# Altium project Hydrophones DAQ.PrjPcb (part 2 of 2)

## Sheet battery.SchDoc
size A
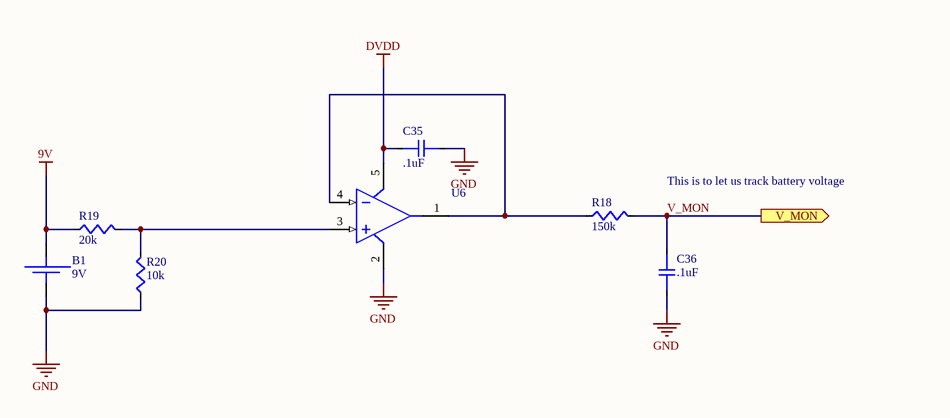
[diagram p4: battery.SchDoc]

### Parts
(Parts that share a designator on the sheet are numbered #1, #2 ... from top to bottom, then left to right.)
B1  9V  [HEADERPINS_2x1_Power]
C35#2  .1uF  [C0603]
C36#2  .1uF  [C0603]
R18#2  150k  [R0603]
R19#2  20k  [R0603]
R20#2  10k  [R0603]
U6#2  OPA325  [SOT-23-5-ALT]  (value not drawn)

### Ports
V_MON (out)

### Nets
9V: B1.+ R19#2.1
DVDD: C35#2.1 U6#2.5(VS+)
GND: B1.- C35#2.2 C36#2.1 R20#2.1 U6#2.2(VS-)
V_MON: C36#2.2 R18#2.2 ; port V_MON
NetR18#2_1: R18#2.1 U6#2.1(OUT) U6#2.4(-IN)
NetR19#2_2: R19#2.2 R20#2.2 U6#2.3(+IN)

### Notes on the sheet
- This is to let us track battery voltage

### Library data of the parts
B1 = 9V_BAT_conn_ 282837-2: Supplier 1: Digi-Key; Supplier Part Number 1: A113320-ND
C35#2 C36#2 = VJ0603Y104JXJCW1BC: 0603 0.1 uF 16 V ±5 % Tolerance X7R SMT Multilayer Ceramic Chip Capacitor; Manufacturer 1: Vishay Vitramon; Dielectric Material: Tantalum; Tolerance: 5%; Capacitance: 100nF; Voltage Rating: 16V; Supplier 1: Digi-Key; Supplier Part Number 1: 720-1685-1-ND; Manufacturer Part Number 1: VJ0603Y104JXJCW1BC; Stock 1: 6936; Pricing 1: 1=0.20000, 10=0.13400, 100=0.06780, 500=0.04636, 1000=0.04101 (USD); RoHS: Yes; Mount: Surface Mount; Case/Package: 0603; Number of Pins: 2; Case Code (Imperial): 0603; Case Code (Metric): 1608; Contact Plating: Tin,Matte; Min Operating Temperature: -55°C; Max Operating Temperature: 125°C; Packaging: Tape and Reel; Voltage Rating (DC): 16V; Package Quantity: 4000; Dielectric: X7R; Termination: SMD/SMT; Length: 1.6mm; Height: 0.95mm; Width: 0.8mm; Depth: 0.8mm; Lead Free: Lead Free; ComponentLink1URL: https://datasheet.ciiva.com/5424/vjw1bcbascomseries-223529-5424533.pdf?src-supplier=Mouser; ComponentLink1Description: https://datasheet.ciiva.com/5424/vjw1bcbascomseries-223529-5424533.pdf?src-supplier=Mouser; ComponentLink2URL: https://datasheet.ciiva.com/11491/vjw1bcbascomseries-11491768.pdf?src-supplier=Avnet; ComponentLink2Description: https://datasheet.ciiva.com/11491/vjw1bcbascomseries-11491768.pdf?src-supplier=Avnet; ComponentLink3URL: https://datasheet.ciiva.com/16215/vjw1bcbascomseries-16215161.pdf?src-supplier=Future+Electronics; ComponentLink3Description: https://datasheet.ciiva.com/16215/vjw1bcbascomseries-16215161.pdf?src-supplier=Future+Electronics
R18#2 = CRGCQ0603F150K: CRGCQ 0603 150K 1%; Manufacturer 1: Yageo; Manufacturer Part Number 1: RC0603JR-0710KL; Resistance: 10kR; Tolerance: 5%; Temperature Coefficient: 100ppm/°C; Voltage Rating (DC): 50V; Power Rating: 100mW; Supplier 1: Digi-Key; Stock 1: 22910838; Pricing 1: 1=0.10000, 10=0.01700, 100=0.00710, 1000=0.00318, 2500=0.00276 (USD); RoHS: Yes; Case/Package: 0603; Number of Pins: 2; Contact Plating: Tin,Matte; Case Code (Imperial): 0603; Case Code (Metric): 1608; Min Operating Temperature: -55°C; Max Operating Temperature: 155°C; Composition: Thick Film; Packaging: Tape and Reel; Voltage Rating: 50V; Termination: SMD/SMT; Military Standard: Not; Length: 1.6mm; Width: 0.8mm; Depth: 0.8mm; Radiation Hardening: No; REACH SVHC: Unknown; Lead Free: Lead Free; ComponentLink1URL: https://datasheet.ciiva.com/2452/pyu-rc0603-51-rohs-l-4-2452848.pdf?src-supplier=Digi-Key; ComponentLink1Description: https://datasheet.ciiva.com/2452/pyu-rc0603-51-rohs-l-4-2452848.pdf?src-supplier=Digi-Key; ComponentLink2URL: https://datasheet.ciiva.com/7746/443971-7746427.pdf?src-supplier=Element14; ComponentLink2Description: https://datasheet.ciiva.com/7746/443971-7746427.pdf?src-supplier=Element14; ComponentLink3URL: https://datasheet.ciiva.com/22747/443971-22747531.pdf?src-supplier=Element14; ComponentLink3Description: https://datasheet.ciiva.com/22747/443971-22747531.pdf?src-supplier=Element14; ComponentLink4URL: https://datasheet.ciiva.com/7746/443971-7746428.pdf?src-supplier=Element14; ComponentLink4Description: https://datasheet.ciiva.com/7746/443971-7746428.pdf?src-supplier=Element14; ComponentLink5URL: https://datasheet.ciiva.com/15189/getdatasheetpartid-327958-15189847.pdf?src-supplier=Verical; ComponentLink5Description: https://datasheet.ciiva.com/15189/getdatasheetpartid-327958-15189847.pdf?src-supplier=Verical; ComponentLink6URL: https://datasheet.ciiva.com/8883/pyu-rc0603-51-rohs-l-4-8883049.pdf?src-supplier=Avnet; ComponentLink6Description: https://datasheet.ciiva.com/8883/pyu-rc0603-51-rohs-l-4-8883049.pdf?src-supplier=Avnet; Supplier Part Number 1: 311-10KGRCT-ND
R19#2 = MCT06030E2002BP500: Res Thin Film 0603 20K Ohm 0.1% 0.1W(1/10W) ±15ppm/C Molded SMD Automotive Medical Paper T/R; Manufacturer 1: Vishay Semiconductors; Resistance: 20kR; Temperature Coefficient: 15ppm/°C; Supplier 1: Digi-Key; Manufacturer Part Number 1: MCT06030E2002BP500; Stock 1: 75960; Pricing 1: 1=0.70000, 10=0.58600, 100=0.39360, 1000=0.23128 (USD); RoHS: Yes; Case/Package: 0603; Contact Plating: Tin; Min Operating Temperature: -55°C; Max Operating Temperature: 125°C; Tolerance: 0.1%; Composition: Thin Film; Packaging: Tape and Reel; Military Standard: Not; Length: 1.55mm; Depth: 0.85mm; Radiation Hardening: No; Lead Free: Lead Free; ComponentLink1URL: https://datasheet.ciiva.com/17185/mc-pre-17185448.pdf?src-supplier=Avnet+Europe; ComponentLink1Description: https://datasheet.ciiva.com/17185/mc-pre-17185448.pdf?src-supplier=Avnet+Europe; ComponentLink2URL: https://datasheet.ciiva.com/8897/mc-pre-8897916.pdf?src-supplier=Avnet; ComponentLink2Description: https://datasheet.ciiva.com/8897/mc-pre-8897916.pdf?src-supplier=Avnet; Supplier Part Number 1: 749-1747-1-ND
R20#2 = RC0603JR-0710KL: RES SMD 10K OHM 5% 1/10W 0603
U6#2 = OPA325IDBVR: Manufacturer 1: Texas Instruments; Supplier 1: Digi-Key; Supplier Part Number 1: 296-OPA325IDBVRCT-ND; Manufacturer Part Number 1: OPA325IDBVR; Stock 1: 2034; Pricing 1: 1=1.69000, 10=1.51600, 25=1.43000, 100=1.14400, 250=1.00100, 500=0.97240, 1000=0.77220 (USD); RoHS: No

## Sheet Ref.SchDoc
size A
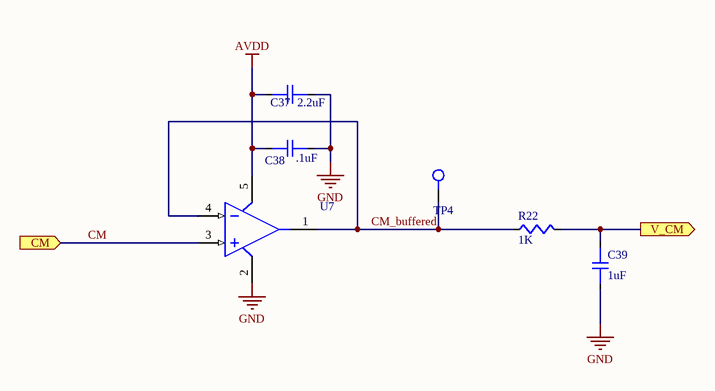
[diagram p5: Ref.SchDoc]

### Parts
(Parts that share a designator on the sheet are numbered #1, #2 ... from top to bottom, then left to right.)
C37  2.2uF  [C0603]
C38  .1uF  [C0603]
C39  1uF  [C0603]
R22#2  1K  [R0603]
TP4  TP  [TP_5029]  (value not drawn)
U7#2  OPA325  [SOT-23-5]  (value not drawn)

### Ports
CM (in), V_CM (out)

### Nets
AVDD: C37.1 C38.1 U7#2.5(VS+)
GND: C37.2 C38.2 C39.1 U7#2.2(VS-)
V_CM: C39.2 R22#2.2 ; port V_CM
CM: U7#2.3(+IN) ; port CM
CM_buffered: R22#2.1 TP4.1 U7#2.1(OUT) U7#2.4(-IN)

### Library data of the parts
C37 = VJ0603Y224KXJCW1BC: Cap Ceramic 0.22uF 16V X7R 10% SMD 0603 125C Paper T/R; Manufacturer 1: Vishay Vitramon; Dielectric Material: Tantalum; Capacitance: 220nF; Supplier 1: Digi-Key; Supplier Part Number 1: 720-1853-1-ND; Manufacturer Part Number 1: VJ0603Y224KXJCW1BC; Stock 1: 890490; Pricing 1: 1=0.10000, 10=0.07000, 100=0.03100, 500=0.02214, 1000=0.01739 (USD); RoHS: Yes; Mount: Surface Mount; Case/Package: 0603; Min Operating Temperature: -55°C; Max Operating Temperature: 125°C; Tolerance: 10%; Packaging: Tape and Reel; Dielectric: X7R; Voltage Rating (DC): 16V; Length: 1.6mm; Depth: 0.8mm; Lead Free: Lead Free; ComponentLink1URL: https://datasheet.ciiva.com/11490/vjw1bcbascomseries-11490982.pdf?src-supplier=Avnet; ComponentLink1Description: https://datasheet.ciiva.com/11490/vjw1bcbascomseries-11490982.pdf?src-supplier=Avnet
C38 = VJ0603Y104JXJCW1BC: as C35#2 on sheet battery; Supplier 1: Digi-Key; Supplier Part Number 1: 720-1685-1-ND; Manufacturer Part Number 1: VJ0603Y104JXJCW1BC; Stock 1: 6936; Pricing 1: 1=0.20000, 10=0.13400, 100=0.06780, 500=0.04636, 1000=0.04101 (USD); RoHS: Yes; Mount: Surface Mount; Case/Package: 0603; Number of Pins: 2; Case Code (Imperial): 0603; Case Code (Metric): 1608; Contact Plating: Tin,Matte; Min Operating Temperature: -55°C; Max Operating Temperature: 125°C; Packaging: Tape and Reel; Voltage Rating (DC): 16V; Package Quantity: 4000; Dielectric: X7R; Termination: SMD/SMT; Length: 1.6mm; Height: 0.95mm; Width: 0.8mm; Depth: 0.8mm; Lead Free: Lead Free; ComponentLink1URL: https://datasheet.ciiva.com/5424/vjw1bcbascomseries-223529-5424533.pdf?src-supplier=Mouser; ComponentLink1Description: https://datasheet.ciiva.com/5424/vjw1bcbascomseries-223529-5424533.pdf?src-supplier=Mouser; ComponentLink2URL: https://datasheet.ciiva.com/11491/vjw1bcbascomseries-11491768.pdf?src-supplier=Avnet; ComponentLink2Description: https://datasheet.ciiva.com/11491/vjw1bcbascomseries-11491768.pdf?src-supplier=Avnet; ComponentLink3URL: https://datasheet.ciiva.com/16215/vjw1bcbascomseries-16215161.pdf?src-supplier=Future+Electronics; ComponentLink3Description: https://datasheet.ciiva.com/16215/vjw1bcbascomseries-16215161.pdf?src-supplier=Future+Electronics
C39 = CL10B105KO8NNNC: Cap Ceramic 1uF 16V X7R 10% SMD 0603 125C T/R; Manufacturer 1: Samsung; Supplier 1: Digi-Key; Supplier Part Number 1: 1276-1019-1-ND; Manufacturer Part Number 1: CL10B105KO8NNNC; Stock 1: 4048324; Pricing 1: 1=0.10000, 10=0.04800, 100=0.02120, 500=0.01516, 1000=0.01192 (USD); RoHS: Yes; Mount: Surface Mount; Case/Package: 0603; Case Code (Metric): 1608; Case Code (Imperial): 0603; Material: Ceramic; Min Operating Temperature: -55°C; Max Operating Temperature: 125°C; Packaging: Tape and Reel; Tolerance: 10%; Capacitance: 1uF; Voltage Rating: 16V; Dielectric: X7R; Voltage: 16V; Voltage Rating (DC): 16V; Length: 1.6mm; Height: 0.8mm; Width: 0.031inch; Thickness: 0.035inch; Depth: 0.8mm; Radiation Hardening: No; Lead Free: Lead Free; ComponentLink1URL: https://datasheet.ciiva.com/15195/getdatasheetpartid-357418-15195728.pdf?src-supplier=Verical; ComponentLink1Description: https://datasheet.ciiva.com/15195/getdatasheetpartid-357418-15195728.pdf?src-supplier=Verical; ComponentLink2URL: https://datasheet.ciiva.com/29198/458176-da-01-en-vs-kondensator-0603-29198478.pdf?src-supplier=Conrad; ComponentLink2Description: https://datasheet.ciiva.com/29198/458176-da-01-en-vs-kondensator-0603-29198478.pdf?src-supplier=Conrad
R22#2 = TNPW06031K00BEEA: RES 1K OHM 0.1% 1/8W 0603; Manufacturer 1: Vishay Dale; Tolerance: 1%; Resistance: 1kR; Temperature Coefficient: 25ppm/°C; Power Rating: 100mW; Voltage Rating: 75V; Supplier 1: Digi-Key; Supplier Part Number 1: TNP1.00KAACT-ND; Manufacturer Part Number 1: TNPW06031K00BEEA; Stock 1: 92047; Pricing 1: 1=0.65000, 10=0.46200, 100=0.24020, 1000=0.12936, 2500=0.12760 (USD); RoHS: Yes; Mount: Surface Mount; Case/Package: 0603; Weight: 7.1E-05oz; Contact Plating: Tin; Case Code (Metric): 1608; Case Code (Imperial): 0603; Min Operating Temperature: -55°C; Max Operating Temperature: 125°C; Composition: Thin Film; Packaging: Tape and Reel; Package Quantity: 1; Number of Terminations: 2; Termination: SMD/SMT; Military Standard: Not; Max Power Dissipation: 100mW; Voltage Rating (DC): 75V; Features: Moisture Resistant,Automotive AEC-Q200,Anti-Sulfur; Length: 1.6mm; Height: 0.45mm; Width: 0.033inch; Depth: 0.85mm; Radiation Hardening: No; REACH SVHC: Unknown; Lead Free: Lead Free; ComponentLink1URL: https://datasheet.ciiva.com/2528/tnpw-e3-2528472.pdf?src-supplier=Digi-Key; ComponentLink1Description: https://datasheet.ciiva.com/2528/tnpw-e3-2528472.pdf?src-supplier=Digi-Key; ComponentLink2URL: https://datasheet.ciiva.com/2528/tnpw-e3-2528473.pdf?src-supplier=Digi-Key; ComponentLink2Description: https://datasheet.ciiva.com/2528/tnpw-e3-2528473.pdf?src-supplier=Digi-Key; ComponentLink3URL: https://datasheet.ciiva.com/9112/tnpw-e3-9112138.pdf?src-supplier=Avnet; ComponentLink3Description: https://datasheet.ciiva.com/9112/tnpw-e3-9112138.pdf?src-supplier=Avnet; ComponentLink4URL: https://datasheet.ciiva.com/16391/tnpw-e3-16391675.pdf?src-supplier=Future+Electronics; ComponentLink4Description: https://datasheet.ciiva.com/16391/tnpw-e3-16391675.pdf?src-supplier=Future+Electronics; ComponentLink5URL: https://datasheet.ciiva.com/9112/tnpw-e3-9112141.pdf?src-supplier=Avnet; ComponentLink5Description: https://datasheet.ciiva.com/9112/tnpw-e3-9112141.pdf?src-supplier=Avnet; ComponentLink6URL: https://datasheet.ciiva.com/16782/70201627-16782047.pdf?src-supplier=Allied+Electronics; ComponentLink6Description: https://datasheet.ciiva.com/16782/70201627-16782047.pdf?src-supplier=Allied+Electronics
TP4 = TP: RCT-0C SMD 0805 TP; Supplier 1: Digi-Key; Supplier Part Number 1: A106144CT-ND
U7#2 = OPA325IDBVR: Manufacturer 1: Texas Instruments; Supplier 1: Digi-Key; Supplier Part Number 1: 296-OPA325IDBVRCT-ND; Manufacturer Part Number 1: OPA325IDBVR; Stock 1: 2034; Pricing 1: 1=1.69000, 10=1.51600, 25=1.43000, 100=1.14400, 250=1.00100, 500=0.97240, 1000=0.77220 (USD); RoHS: No

## Sheet 3V3Supply.SchDoc
size A
Used 2 times, as channels DVDD, AVDD. Parts and nets are listed once, with the designators drawn on the sheet.
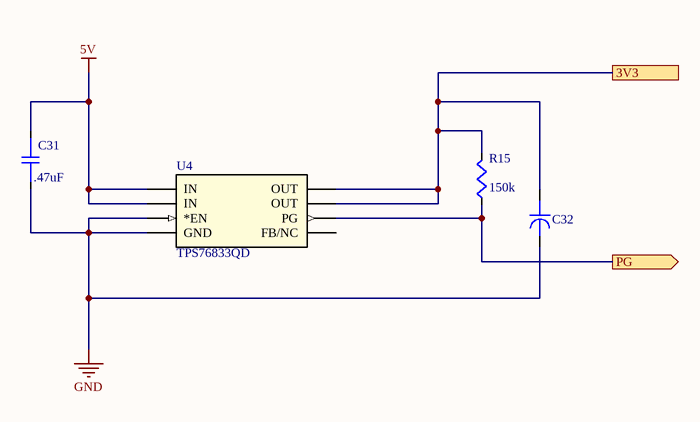
[diagram p6: 3V3Supply.SchDoc]

### Parts
C31  .47uF  [C0603]
C32  22UF TANT  [CAP_293D_D_VIS]  (value not drawn)
R15  150k  [R0603]
U4  TPS76833QD  [D8_TEX]

### Ports
3V3, PG (out)

### Nets
5V: C31.2 U4.3(IN) U4.4(IN)
GND: C31.1 C32.1 U4.1(GND) U4.2(*EN)
3V3: C32.2 R15.2 U4.5(OUT) U4.6(OUT) ; port 3V3
PG: R15.1 U4.8(PG) ; port PG

Not connected (* = marked no-connect by the designer): U4 7(FB/NC)

### Channels
DVDD: designators C31=C70 C32=C68 R15=R50 U4=U15; ports 3V3=DVDD PG=DVDD_PG
AVDD: designators C31=C60 C32=C47 R15=R34 U4=U11; ports 3V3=AVDD PG=AVDD_PG

### Library data of the parts
C31 = C0603C474J4RACAUTO: KEMET - C0603C474J4RACAUTO - CAP, 0.47µF, 16V, 5%, X7R, 0603; Capacitance: 470nF; Supplier 1: Digi-Key; Supplier Part Number 1: 399-17596-1-ND; Manufacturer 1: KEMET; Manufacturer Part Number 1: C0603C474J4RACAUTO; Stock 1: 10040; Pricing 1: 1=0.51000, 10=0.35800, 100=0.23570, 500=0.17462, 1000=0.14842 (USD); RoHS: Yes; Case/Package: 0603; Min Operating Temperature: -55°C; Max Operating Temperature: 125°C; Dielectric: X7R; Tolerance: 5%; Packaging: Tape and Reel; Length: 1.6mm; Depth: 0.8mm; ComponentLink1URL: http://www.farnell.com/datasheets/2749769.pdf?src-supplier=Farnell; ComponentLink1Description: http://www.farnell.com/datasheets/2749769.pdf?src-supplier=Farnell; ComponentLink2URL: http://components.arrow.com/part/dataview/0323_07310140?src-supplier=Arrow+Europe; ComponentLink2Description: http://components.arrow.com/part/dataview/0323_07310140?src-supplier=Arrow+Europe; ComponentLink3URL: https://api.kemet.com/component-edge/download/datasheet/C0603C474J4RACAUTO.pdf?src-supplier=Digi-Key; ComponentLink3Description: https://api.kemet.com/component-edge/download/datasheet/C0603C474J4RACAUTO.pdf?src-supplier=Digi-Key; ComponentLink4URL: http://www.farnell.com/datasheets/2749769.pdf?src-supplier=Element14; ComponentLink4Description: http://www.farnell.com/datasheets/2749769.pdf?src-supplier=Element14; ComponentLink5URL: http://www.farnell.com/datasheets/2749769.pdf?src-supplier=Newark; ComponentLink5Description: http://www.farnell.com/datasheets/2749769.pdf?src-supplier=Newark
C32 = 293D226X9035D2TE3: CAP TANT 22UF 10% 35V 2917; Manufacturer 1: Vishay Sprague; Dielectric Material: Tantalum; ESR (Equivalent Series Resistance): 600mR; Polarity: Polar; Ripple Current: 500mA; Dissipation Factor: 6%; Voltage Rating (DC): 300kV; Leakage Current: 7.7uA; Supplier 1: Digi-Key; Supplier Part Number 1: 718-1071-1-ND; Manufacturer Part Number 1: 293D226X9035D2TE3; RoHS: Yes; Category: Tantalum Capacitors; Stock 1: 31; Pricing 1: 1=1.00000, 10=0.78800, 50=0.68260, 100=0.59060 (USD); Mount: Surface Mount,PCB; Case/Package: 2917; Case Code (Imperial): 2917; Case Code (Metric): 7343; Weight: 0.023634oz; Min Operating Temperature: -55°C; Max Operating Temperature: 125°C; Capacitance: 22uF; Tolerance: 10%; Voltage: 35V; Voltage Rating: 35V; Packaging: Tape and Reel; Package Quantity: 1; Termination: SMD/SMT; Features: General Purpose; Length: 7.3mm; Width: 2.8mm; Height: 2.8mm; Depth: 4.3mm; Height - Seated (Max): 0.122inch; Radiation Hardening: No; Lead Free: Lead Free; REACH SVHC: Unknown; ComponentLink1URL: https://datasheet.ciiva.com/11793/0900766b80d97b37-11793792.pdf?src-supplier=RSComponents; ComponentLink1Description: https://datasheet.ciiva.com/11793/0900766b80d97b37-11793792.pdf?src-supplier=RSComponents; ComponentLink2URL: https://datasheet.ciiva.com/3003/293d-3003938.pdf?src-supplier=Avnet; ComponentLink2Description: https://datasheet.ciiva.com/3003/293d-3003938.pdf?src-supplier=Avnet; ComponentLink3URL: https://datasheet.ciiva.com/16357/293d-16357928.pdf?src-supplier=Future+Electronics; ComponentLink3Description: https://datasheet.ciiva.com/16357/293d-16357928.pdf?src-supplier=Future+Electronics; ComponentLink4URL: https://datasheet.ciiva.com/22695/438417-22695144.pdf?src-supplier=Element14; ComponentLink4Description: https://datasheet.ciiva.com/22695/438417-22695144.pdf?src-supplier=Element14; ComponentLink5URL: https://datasheet.ciiva.com/260/293d-260029.pdf?src-supplier=Digi-Key; ComponentLink5Description: https://datasheet.ciiva.com/260/293d-260029.pdf?src-supplier=Digi-Key; ComponentLink6URL: https://datasheet.ciiva.com/260/293d-260031.pdf?src-supplier=Digi-Key; ComponentLink6Description: https://datasheet.ciiva.com/260/293d-260031.pdf?src-supplier=Digi-Key; ComponentLink7URL: https://datasheet.ciiva.com/1463/438417-1463353.pdf?src-supplier=Element14; ComponentLink7Description: https://datasheet.ciiva.com/1463/438417-1463353.pdf?src-supplier=Element14; ComponentLink8URL: https://datasheet.ciiva.com/260/293d-260030.pdf?src-supplier=Digi-Key; ComponentLink8Description: https://datasheet.ciiva.com/260/293d-260030.pdf?src-supplier=Digi-Key
R15 = CRGCQ0603F150K: as R18#2 on sheet battery; Supplier 1: Digi-Key; Stock 1: 22910838; Pricing 1: 1=0.10000, 10=0.01700, 100=0.00710, 1000=0.00318, 2500=0.00276 (USD); RoHS: Yes; Case/Package: 0603; Number of Pins: 2; Contact Plating: Tin,Matte; Case Code (Imperial): 0603; Case Code (Metric): 1608; Min Operating Temperature: -55°C; Max Operating Temperature: 155°C; Composition: Thick Film; Packaging: Tape and Reel; Voltage Rating: 50V; Termination: SMD/SMT; Military Standard: Not; Length: 1.6mm; Width: 0.8mm; Depth: 0.8mm; Radiation Hardening: No; REACH SVHC: Unknown; Lead Free: Lead Free; ComponentLink1URL: https://datasheet.ciiva.com/2452/pyu-rc0603-51-rohs-l-4-2452848.pdf?src-supplier=Digi-Key; ComponentLink1Description: https://datasheet.ciiva.com/2452/pyu-rc0603-51-rohs-l-4-2452848.pdf?src-supplier=Digi-Key; ComponentLink2URL: https://datasheet.ciiva.com/7746/443971-7746427.pdf?src-supplier=Element14; ComponentLink2Description: https://datasheet.ciiva.com/7746/443971-7746427.pdf?src-supplier=Element14; ComponentLink3URL: https://datasheet.ciiva.com/22747/443971-22747531.pdf?src-supplier=Element14; ComponentLink3Description: https://datasheet.ciiva.com/22747/443971-22747531.pdf?src-supplier=Element14; ComponentLink4URL: https://datasheet.ciiva.com/7746/443971-7746428.pdf?src-supplier=Element14; ComponentLink4Description: https://datasheet.ciiva.com/7746/443971-7746428.pdf?src-supplier=Element14; ComponentLink5URL: https://datasheet.ciiva.com/15189/getdatasheetpartid-327958-15189847.pdf?src-supplier=Verical; ComponentLink5Description: https://datasheet.ciiva.com/15189/getdatasheetpartid-327958-15189847.pdf?src-supplier=Verical; ComponentLink6URL: https://datasheet.ciiva.com/8883/pyu-rc0603-51-rohs-l-4-8883049.pdf?src-supplier=Avnet; ComponentLink6Description: https://datasheet.ciiva.com/8883/pyu-rc0603-51-rohs-l-4-8883049.pdf?src-supplier=Avnet; Supplier Part Number 1: 311-10KGRCT-ND
U4 = TPS76833QD: 3.3V Linear Voltage Regulator IC 1 Output 1A 8-SOIC; Vendor: Texas Instruments; Built_By: EMA_UL_Team; SourceLibrary: TI_2011-12-14_2; Manufacturer_Part_Number: TPS76833QD; Copyright: Copyright (C) 2018 Accelerated Designs. All rights reserved; RefDes: RefDes; Type: DEV

## Sheet 5VSupply.SchDoc
size A
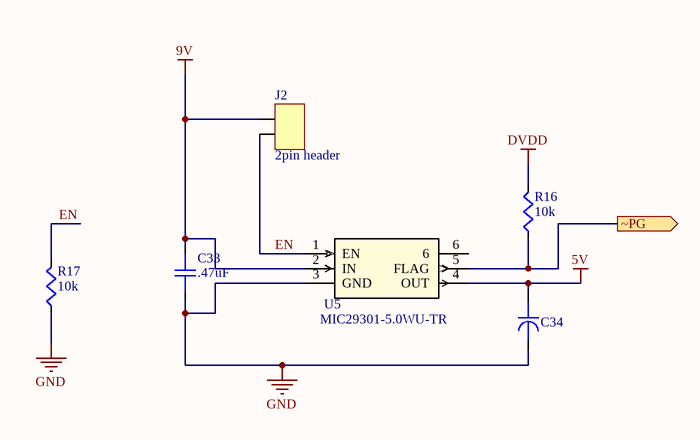
[diagram p7: 5VSupply.SchDoc]

### Parts
(Parts that share a designator on the sheet are numbered #1, #2 ... from top to bottom, then left to right.)
C33#2  .47uF  [C0805]
C34#2  22UF TANT  [CAP_293D_D_VIS]  (value not drawn)
J2#2  2pin header  [HEADERPINS_2x1]
R16#2  10k  [R0603]
R17#2  10k  [R0603]
U5#2  MIC29301-5.0WU-TR  [TO-263-5_MCH]

### Ports
~PG (out)

### Nets
5V: C34#2.2 U5#2.4(OUT)
9V: C33#2.2 J2#2.2 U5#2.2(IN)
DVDD: R16#2.2
GND: C33#2.1 C34#2.1 R17#2.1 U5#2.3(GND)
EN: J2#2.1 R17#2.2 U5#2.1(EN)
~5V_PG: R16#2.1 U5#2.5(FLAG) ; port ~PG

Not connected (* = marked no-connect by the designer): U5#2 6

### Library data of the parts
C33#2 = VJ0805Y474JXJTW1BC: Multilayer Ceramic Capacitors MLCC - SMD/SMT 0805 0.47uF 16volts X7R 5%; Manufacturer 1: Vishay Vitramon; Dielectric Material: Tantalum; Voltage Rating (DC): 16V; Capacitance: 470nF; Supplier 1: Digi-Key; Supplier Part Number 1: 720-1774-1-ND; Manufacturer Part Number 1: VJ0805Y474JXJTW1BC; Stock 1: 1897; Pricing 1: 1=0.39000, 10=0.27000, 100=0.16180, 500=0.12132, 1000=0.10245 (USD); RoHS: Yes; Mount: Surface Mount; Case/Package: 0805; Case Code (Imperial): 0805; Case Code (Metric): 2012; Min Operating Temperature: -55°C; Max Operating Temperature: 125°C; Tolerance: 5%; Packaging: Tape and Reel; Package Quantity: 3000; Dielectric: X7R; Termination: SMD/SMT; Length: 2mm; Height: 1.45mm; Width: 1.25mm; Depth: 1.25mm; Lead Free: Lead Free; ComponentLink1URL: https://datasheet.ciiva.com/11490/vjw1bcbascomseries-11490678.pdf?src-supplier=Avnet; ComponentLink1Description: https://datasheet.ciiva.com/11490/vjw1bcbascomseries-11490678.pdf?src-supplier=Avnet; ComponentLink2URL: https://datasheet.ciiva.com/5427/vjw1bcbascomseries-223529-5427159.pdf?src-supplier=Mouser; ComponentLink2Description: https://datasheet.ciiva.com/5427/vjw1bcbascomseries-223529-5427159.pdf?src-supplier=Mouser
C34#2 = 293D226X9035D2TE3: as C32 on sheet 3V3Supply; Supplier 1: Digi-Key; Supplier Part Number 1: 718-1071-1-ND; Manufacturer Part Number 1: 293D226X9035D2TE3; RoHS: Yes; Category: Tantalum Capacitors; Stock 1: 31; Pricing 1: 1=1.00000, 10=0.78800, 50=0.68260, 100=0.59060 (USD); Mount: Surface Mount,PCB; Case/Package: 2917; Case Code (Imperial): 2917; Case Code (Metric): 7343; Weight: 0.023634oz; Min Operating Temperature: -55°C; Max Operating Temperature: 125°C; Capacitance: 22uF; Tolerance: 10%; Voltage: 35V; Voltage Rating: 35V; Packaging: Tape and Reel; Package Quantity: 1; Termination: SMD/SMT; Features: General Purpose; Length: 7.3mm; Width: 2.8mm; Height: 2.8mm; Depth: 4.3mm; Height - Seated (Max): 0.122inch; Radiation Hardening: No; Lead Free: Lead Free; REACH SVHC: Unknown; ComponentLink1URL: https://datasheet.ciiva.com/11793/0900766b80d97b37-11793792.pdf?src-supplier=RSComponents; ComponentLink1Description: https://datasheet.ciiva.com/11793/0900766b80d97b37-11793792.pdf?src-supplier=RSComponents; ComponentLink2URL: https://datasheet.ciiva.com/3003/293d-3003938.pdf?src-supplier=Avnet; ComponentLink2Description: https://datasheet.ciiva.com/3003/293d-3003938.pdf?src-supplier=Avnet; ComponentLink3URL: https://datasheet.ciiva.com/16357/293d-16357928.pdf?src-supplier=Future+Electronics; ComponentLink3Description: https://datasheet.ciiva.com/16357/293d-16357928.pdf?src-supplier=Future+Electronics; ComponentLink4URL: https://datasheet.ciiva.com/22695/438417-22695144.pdf?src-supplier=Element14; ComponentLink4Description: https://datasheet.ciiva.com/22695/438417-22695144.pdf?src-supplier=Element14; ComponentLink5URL: https://datasheet.ciiva.com/260/293d-260029.pdf?src-supplier=Digi-Key; ComponentLink5Description: https://datasheet.ciiva.com/260/293d-260029.pdf?src-supplier=Digi-Key; ComponentLink6URL: https://datasheet.ciiva.com/260/293d-260031.pdf?src-supplier=Digi-Key; ComponentLink6Description: https://datasheet.ciiva.com/260/293d-260031.pdf?src-supplier=Digi-Key; ComponentLink7URL: https://datasheet.ciiva.com/1463/438417-1463353.pdf?src-supplier=Element14; ComponentLink7Description: https://datasheet.ciiva.com/1463/438417-1463353.pdf?src-supplier=Element14; ComponentLink8URL: https://datasheet.ciiva.com/260/293d-260030.pdf?src-supplier=Digi-Key; ComponentLink8Description: https://datasheet.ciiva.com/260/293d-260030.pdf?src-supplier=Digi-Key
J2#2 = J2
R16#2 R17#2 = RC0603JR-0710KL: RES SMD 10K OHM 5% 1/10W 0603
U5#2 = MIC29301-5.0WU-TR: LDO Regulator Pos 5V 3A Automotive 6-Pin(5+Tab) TO-263 T/R; Manufacturer 1: Microchip; Supplier 1: Digi-Key; Supplier Part Number 1: MIC29301-5.0WU-CT-ND; Manufacturer Part Number 1: MIC29301-5.0WU-TR; RoHS: Yes; Category: Voltage Regulators - Linear; Stock 1: 1017; Pricing 1: 1=4.14000, 25=3.45000, 100=3.14000 (USD); ComponentLink1URL: https://datasheet.ciiva.com/16389/mic29150-16389820.pdf?src-supplier=Future+Electronics; ComponentLink1Description: https://datasheet.ciiva.com/16389/mic29150-16389820.pdf?src-supplier=Future+Electronics; ComponentLink2URL: https://datasheet.ciiva.com/2064/mic29150-2064680.pdf?src-supplier=Digi-Key; ComponentLink2Description: https://datasheet.ciiva.com/2064/mic29150-2064680.pdf?src-supplier=Digi-Key

## Sheet Teensy.SchDoc
size A
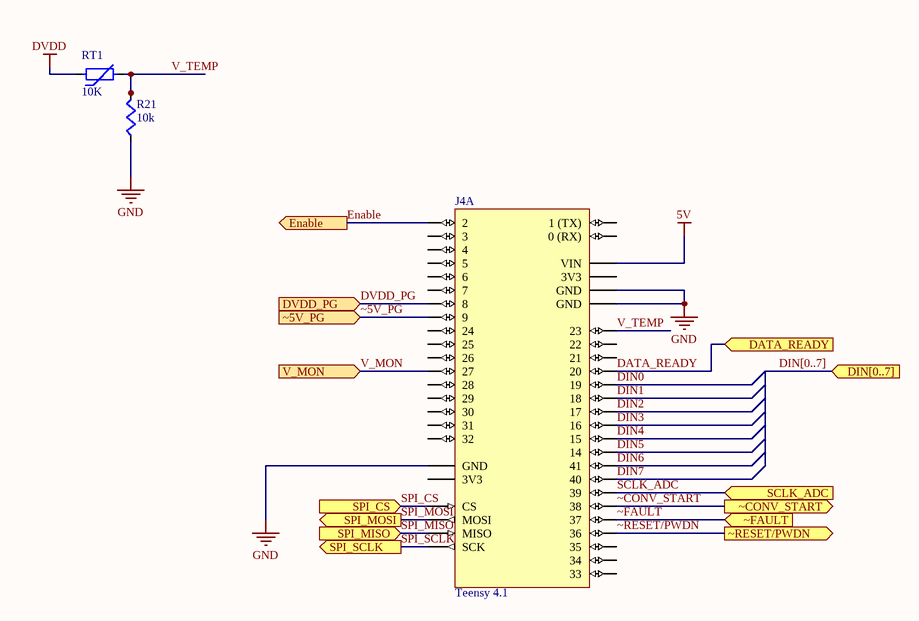
[diagram p8: Teensy.SchDoc]

### Parts
(Parts that share a designator on the sheet are numbered #1, #2 ... from top to bottom, then left to right.)
J4#2  Teensy 4.1  [Teensy4.1]  (part A of 2)
R21#2  10k  [R0603]
RT1  10K  [R0603]

### Ports
DATA_READY (in), DIN[0..7] (in), DVDD_PG (in), Enable (out), SCLK_ADC (in), SPI_CS (in), SPI_MISO (in), SPI_MOSI (out), SPI_SCLK (out), V_MON (in), ~5V_PG (in), ~CONV_START (out), ~FAULT (in), ~RESET/PWDN (out)

### Nets
5V: J4#2.48(VIN)
DVDD: RT1.1
GND: J4#2.1(GND) J4#2.34(GND) J4#2.47(GND) R21#2.1
DATA_READY: J4#2.42(20) ; port DATA_READY
DIN0: J4#2.41(19)  [project net ADC_DATA0]
DIN1: J4#2.40(18)  [project net ADC_DATA1]
DIN2: J4#2.39(17)  [project net ADC_DATA2]
DIN3: J4#2.38(16)  [project net ADC_DATA3]
DIN4: J4#2.37(15)  [project net ADC_DATA4]
DIN5: J4#2.36(14)  [project net ADC_DATA5]
DIN6: J4#2.33(41)  [project net ADC_DATA6]
DIN7: J4#2.32(40)  [project net ADC_DATA7]
DVDD_PG: J4#2.10(8) ; port DVDD_PG
Enable: J4#2.4(2) ; port Enable
SCLK_ADC: J4#2.31(39) ; port SCLK_ADC
SPI_CS: J4#2.12(CS) ; port SPI_CS
SPI_MISO: J4#2.14(MISO) ; port SPI_MISO  [project net MISO_ADC]
SPI_MOSI: J4#2.13(MOSI) ; port SPI_MOSI  [project net MOSI_ADC]
SPI_SCLK: J4#2.35(SCK) ; port SPI_SCLK  [project net SPI_CLK]
V_MON: J4#2.19(27) ; port V_MON
V_TEMP: J4#2.45(23) R21#2.2 RT1.2
~5V_PG: J4#2.11(9) ; port ~5V_PG
~CONV_START: J4#2.30(38) ; port ~CONV_START
~FAULT: J4#2.29(37) ; port ~FAULT
~RESET/PWDN: J4#2.28(36) ; port ~RESET/PWDN

Not connected (* = marked no-connect by the designer): J4#2 2(0_(RX)) 3(1_(TX)) 5(3) 6(4) 7(5) 8(6) 9(7) 15(3V3) 16(24) 17(25) 18(26) 20(28) 21(29) 22(30) 23(31) 24(32) 25(33) 26(34) 27(35) 43(21) 44(22) 46(3V3)

### Buses and harness runs
bus DIN[0..7] = port DIN[0..7]

### Library data of the parts
J4#2 = Teensy4.1
R21#2 = RC0603JR-0710KL: RES SMD 10K OHM 5% 1/10W 0603
RT1 = ERT-J1VG103JA: Thermistor NTC 10KOhm 5% 2-Pin 0603 Punched Carrier T/R; Manufacturer 1: Panasonic; Max Power Dissipation: 100mW; Accuracy: 1%; Resistance: 10kR; Supplier 1: Digi-Key; Supplier Part Number 1: P12014CT-ND; Manufacturer Part Number 1: ERT-J1VG103JA; Stock 1: 47318; Pricing 1: 1=0.15000, 5=0.14600, 10=0.13000, 25=0.12000, 50=0.09600, 100=0.08240, 500=0.07208, 1000=0.06178 (USD); RoHS: Yes; Mount: Surface Mount; Case/Package: 0603; Number of Pins: 2; Case Code (Metric): 1608; Case Code (Imperial): 0603; Min Operating Temperature: -40°C; Max Operating Temperature: 125°C; Termination: SMD/SMT; Packaging: Tape and Reel; Tolerance: 5%; Package Quantity: 4000; Length: 1.6mm; Depth: 0.8mm; Width: 800um; Radiation Hardening: No; Lead Free: Lead Free; REACH SVHC: No SVHC; ComponentLink1URL: https://datasheet.ciiva.com/1303/1314428-1303168.pdf?src-supplier=Farnell; ComponentLink1Description: https://datasheet.ciiva.com/1303/1314428-1303168.pdf?src-supplier=Farnell; ComponentLink2URL: https://datasheet.ciiva.com/30067/aua0000ce1-30067157.pdf?src-supplier=Onlinecomponents.com; ComponentLink2Description: https://datasheet.ciiva.com/30067/aua0000ce1-30067157.pdf?src-supplier=Onlinecomponents.com; ComponentLink3URL: https://datasheet.ciiva.com/46376/1314428-46376550.pdf?src-supplier=Element14; ComponentLink3Description: https://datasheet.ciiva.com/46376/1314428-46376550.pdf?src-supplier=Element14; ComponentLink4URL: https://datasheet.ciiva.com/2848/aua0000ce1-2848556.pdf?src-supplier=Digi-Key; ComponentLink4Description: https://datasheet.ciiva.com/2848/aua0000ce1-2848556.pdf?src-supplier=Digi-Key; ComponentLink5URL: https://datasheet.ciiva.com/16394/aua0000ce1-16394028.pdf?src-supplier=Future+Electronics; ComponentLink5Description: https://datasheet.ciiva.com/16394/aua0000ce1-16394028.pdf?src-supplier=Future+Electronics; ComponentLink6URL: https://datasheet.ciiva.com/46388/1314428-46388812.pdf?src-supplier=Element14; ComponentLink6Description: https://datasheet.ciiva.com/46388/1314428-46388812.pdf?src-supplier=Element14; ComponentLink7URL: https://datasheet.ciiva.com/2848/aua0000ce1-2848557.pdf?src-supplier=Digi-Key; ComponentLink7Description: https://datasheet.ciiva.com/2848/aua0000ce1-2848557.pdf?src-supplier=Digi-Key; ComponentLink8URL: https://datasheet.ciiva.com/2848/aua0000ce1-2848558.pdf?src-supplier=Digi-Key; ComponentLink8Description: https://datasheet.ciiva.com/2848/aua0000ce1-2848558.pdf?src-supplier=Digi-Key; ComponentLink9URL: https://datasheet.ciiva.com/3280/aua0000ce1-3280462.pdf?src-supplier=Avnet; ComponentLink9Description: https://datasheet.ciiva.com/3280/aua0000ce1-3280462.pdf?src-supplier=Avnet

## Sheet USB.SchDoc
size A
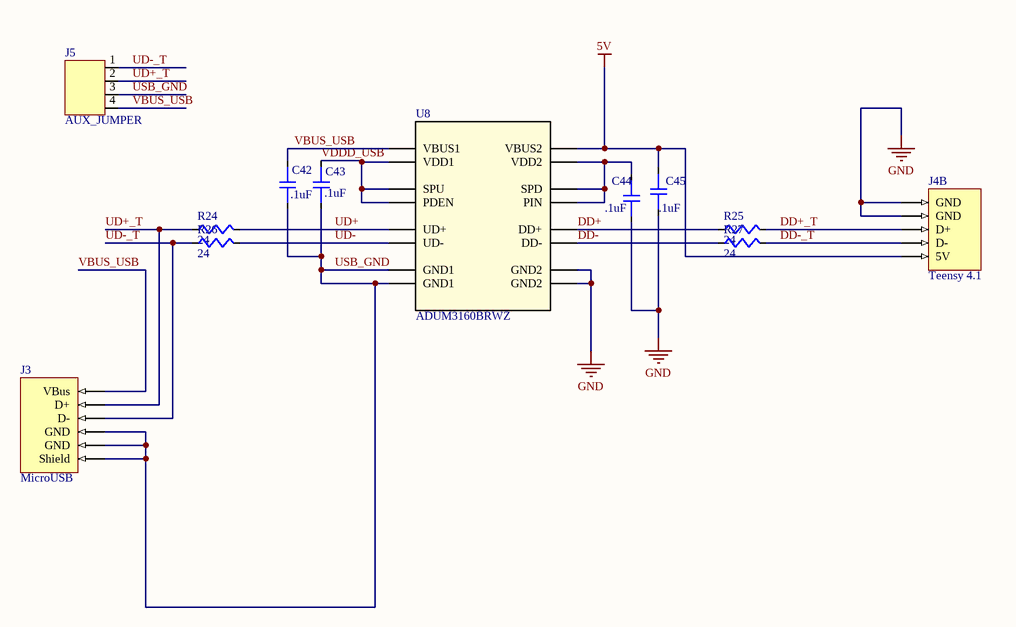
[diagram p9: USB.SchDoc]

### Parts
(Parts that share a designator on the sheet are numbered #1, #2 ... from top to bottom, then left to right.)
C42  .1uF  [C0603]
C43  .1uF  [C0603]
C44  .1uF  [C0603]
C45  .1uF  [C0603]
J3#2  MicroUSB  [HRS_ZX62-B-5PA(33)]
J4#2  Teensy 4.1  [Teensy4.1]  (part B of 2)
J5  AUX_JUMPER  [headerPins_4x1]
R24#2  24  [C0603]
R25#2  24  [C0603]
R26#2  24  [C0603]
R27#2  24  [C0603]
U8#2  ADUM3160BRWZ  [RW_16_ADI-L]

### Nets
5V: C45.2 J4#2.53(5V) U8#2.16(VBUS2)
GND: C44.1 C45.1 J4#2.49(GND) J4#2.50(GND) U8#2.9(GND2) U8#2.15(GND2)
DD+: R25#2.1 U8#2.10(DD+)
DD+_T: J4#2.51(D+) R25#2.2
DD-: R27#2.1 U8#2.11(DD-)
DD-_T: J4#2.52(D-) R27#2.2
UD+: R24#2.2 U8#2.7(UD+)
UD+_T: J3#2.2(D+) J5.2(3V3) R24#2.1
UD-: R26#2.2 U8#2.6(UD-)
UD-_T: J3#2.3(D-) J5.1(GND) R26#2.1
USB_GND: C42.1 C43.1 J3#2.4(GND) J3#2.5(GND) J3#2.6(Shield) J5.3(SDA) U8#2.2(GND1) U8#2.8(GND1)
VBUS_USB: C42.2 J3#2.1(VBus) J5.4(SCL) U8#2.1(VBUS1)
VDDD_USB: C43.2 U8#2.3(VDD1) U8#2.4(PDEN) U8#2.5(SPU)
NetC44_2: C44.2 U8#2.12(PIN) U8#2.13(SPD) U8#2.14(VDD2)

### Library data of the parts
C42-C45 = VJ0603Y104JXJCW1BC: as C35#2 on sheet battery; Supplier 1: Digi-Key; Supplier Part Number 1: 720-1685-1-ND; Manufacturer Part Number 1: VJ0603Y104JXJCW1BC; Stock 1: 6936; Pricing 1: 1=0.20000, 10=0.13400, 100=0.06780, 500=0.04636, 1000=0.04101 (USD); RoHS: Yes; Mount: Surface Mount; Case/Package: 0603; Number of Pins: 2; Case Code (Imperial): 0603; Case Code (Metric): 1608; Contact Plating: Tin,Matte; Min Operating Temperature: -55°C; Max Operating Temperature: 125°C; Packaging: Tape and Reel; Voltage Rating (DC): 16V; Package Quantity: 4000; Dielectric: X7R; Termination: SMD/SMT; Length: 1.6mm; Height: 0.95mm; Width: 0.8mm; Depth: 0.8mm; Lead Free: Lead Free; ComponentLink1URL: https://datasheet.ciiva.com/5424/vjw1bcbascomseries-223529-5424533.pdf?src-supplier=Mouser; ComponentLink1Description: https://datasheet.ciiva.com/5424/vjw1bcbascomseries-223529-5424533.pdf?src-supplier=Mouser; ComponentLink2URL: https://datasheet.ciiva.com/11491/vjw1bcbascomseries-11491768.pdf?src-supplier=Avnet; ComponentLink2Description: https://datasheet.ciiva.com/11491/vjw1bcbascomseries-11491768.pdf?src-supplier=Avnet; ComponentLink3URL: https://datasheet.ciiva.com/16215/vjw1bcbascomseries-16215161.pdf?src-supplier=Future+Electronics; ComponentLink3Description: https://datasheet.ciiva.com/16215/vjw1bcbascomseries-16215161.pdf?src-supplier=Future+Electronics
J3#2 = ZX62-B-5PA(33): HIROSE(HRS) - ZX62-B-5PA(33) - USB-Steckverbinder, Micro-USB Typ B, USB 2.0, Buchse, 5 -polig, Oberflächenmontage, Rechtwinklig; Supplier 1: Digi-Key; Supplier Part Number 1: H125270CT-ND
J4#2 = Teensy4.1
J5 = J4: Supplier 1: Digi-Key; Supplier Part Number 1: SAM10843-ND
R24#2 R25#2 R26#2 R27#2 = ERJU03F24R0V: Thick Film Resistors - SMD 0603 1% 24ohm Anti-Sulfur AEC-Q200; Manufacturer 1: Panasonic; Temperature Coefficient: 100ppm/°C; Current Rating: 1A; Voltage Rating (DC): 75V; Power Rating: 100mW; Resistance: 24R; Supplier 1: Digi-Key; Supplier Part Number 1: 10-ERJ-U03F24R0VCT-ND; Manufacturer Part Number 1: ERJU03F24R0V; RoHS: Yes; Category: Chip SMD Resistors; Stock 1: 298; Pricing 1: 1=0.13000, 10=0.11400, 100=0.04400, 1000=0.01936, 2500=0.01672 (USD); Case/Package: 0603; Case Code (Imperial): 0603; Case Code (Metric): 1608; Weight: 7.1E-05oz; Min Operating Temperature: -55°C; Max Operating Temperature: 155°C; Tolerance: 1%; Voltage Rating: 75V; Packaging: Tape and Reel; Package Quantity: 5000; Resistor Type: Thick Film; Termination: SMD/SMT; Length: 1.6mm; Width: 0.8mm; Height: 0.45mm; Depth: 0.8mm; REACH SVHC: No SVHC; ComponentLink1URL: https://datasheet.ciiva.com/24124/ras-erj-u-267552-24124922.pdf?src-supplier=Mouser; ComponentLink1Description: https://datasheet.ciiva.com/24124/ras-erj-u-267552-24124922.pdf?src-supplier=Mouser; ComponentLink2URL: https://datasheet.ciiva.com/6201/1638979-6201577.pdf?src-supplier=Farnell; ComponentLink2Description: https://datasheet.ciiva.com/6201/1638979-6201577.pdf?src-supplier=Farnell
U8#2 = ADUM3160BRWZ: USB Isolation; SourceLibrary: Analog_2015-12-15; Built_By: EMA_UL_Team; Vendor: Analog Devices Inc; Manufacturer_Part_Number: ADUM3160BRWZ; Copyright: Copyright (C) 2018 Accelerated Designs. All rights reserved; RefDes: RefDes; Type: DEV

## Nets that join several sheets
5V: DVDD (C70.2 U15.3 U15.4), 5VSupply (C34#2.2 U5#2.4), AVDD (C60.2 U11.3 U11.4), Teensy (J4#2.48), USB (C45.2 J4#2.53 U8#2.16)
9V: battery (B1.+ R19#2.1), 5VSupply (C33#2.2 J2#2.2 U5#2.2)
AVDD: ANALOG1 (7 pins), ANALOG2 (7 pins), ANALOG3 (7 pins), ANALOG4 (7 pins), ADC (11 pins), Ref (C37.1 C38.1 U7#2.5), AVDD (C47.2 R34.2 U11.5 U11.6)
DVDD: ADC (9 pins), battery (C35#2.1 U6#2.5), DVDD (C68.2 R50.2 U15.5 U15.6), 5VSupply (R16#2.2), Teensy (RT1.1)
GND: ANALOG1 (8 pins), ANALOG2 (8 pins), ANALOG3 (8 pins), ANALOG4 (8 pins), ADC (30 pins), XTAL (C40.1 C41.1 XTAL1.2 XTAL1.4), battery (5 pins), Ref (C37.2 C38.2 C39.1 U7#2.2), DVDD (C68.1 C70.1 U15.1 U15.2), 5VSupply (C33#2.1 C34#2.1 R17#2.1 U5#2.3), AVDD (C47.1 C60.1 U11.1 U11.2), Teensy (J4#2.1 J4#2.34 J4#2.47 R21#2.1), USB (6 pins)
V_CM: ANALOG1 (J1.2 R17#1.1 U1.3 U5#1.2), ANALOG2 (J2#1.2 R18#1.1 U2.3 U6#1.2), ANALOG3 (J3#1.2 R19#1.1 U3.3 U7#1.2), ANALOG4 (J4#1.2 R20#1.1 U4.3 U8#1.2), Ref (C39.2 R22#2.2)
ADC_DATA0: ADC (U9.26), Teensy (J4#2.41)
ADC_DATA1: ADC (U9.27), Teensy (J4#2.40)
ADC_DATA2: ADC (U9.28), Teensy (J4#2.39)
ADC_DATA3: ADC (U9.29), Teensy (J4#2.38)
ADC_DATA4: ADC (U9.30), Teensy (J4#2.37)
ADC_DATA5: ADC (U9.31), Teensy (J4#2.36)
ADC_DATA6: ADC (R11#2.2 U9.32), Teensy (J4#2.33)
ADC_DATA7: ADC (U9.33), Teensy (J4#2.32)
AINN1: Top (TP1.1), ANALOG1 (C15#1.2 R25#1.2 U5#1.4), ADC (U9.45)
AINN2: ANALOG2 (C18#1.2 R26#1.2 U6#1.4), ADC (U9.47)
AINN3: ANALOG3 (C21#1.2 R27#1.2 U7#1.4), ADC (U9.3)
AINN4: ANALOG4 (C24#1.2 R28.2 U8#1.4), ADC (U9.5)
AINN_BUS1: Top (TP2.1), ANALOG1 (C13#1.1 R29.1 U5#1.5), ADC (U9.44)
AINN_BUS2: ANALOG2 (C16#1.1 R30.1 U6#1.5), ADC (U9.46)
AINN_BUS3: ANALOG3 (C19#1.1 R31.1 U7#1.5), ADC (U9.2)
AINN_BUS4: ANALOG4 (C22#1.1 R32.1 U8#1.5), ADC (U9.4)
AVDD_PG: ADC (U9.7), AVDD (R34.1 U11.8)
CM: ADC (C22#2.2 C23#2.2 U9.8), Ref (U7#2.3)
DATA_READY: ADC (U9.22), Teensy (J4#2.42)
DVDD_PG: DVDD (R50.1 U15.8), Teensy (J4#2.10)
MISO_ADC: ADC (U9.38), Teensy (J4#2.14)
MOSI_ADC: ADC (U9.39), Teensy (J4#2.13)
SCLK_ADC: ADC (TP3.1 U9.34), Teensy (J4#2.31)
SPI_CLK: ADC (U9.40), Teensy (J4#2.35)
SPI_CS: ADC (R13#2.1 U9.41), Teensy (J4#2.12)
V_MON: battery (C36#2.2 R18#2.2), Teensy (J4#2.19)
XIN: ADC (U9.16), XTAL (C40.2 XTAL1.1)
XOUT: ADC (U9.17), XTAL (R23#2.2)
~5V_PG: 5VSupply (R16#2.1 U5#2.5), Teensy (J4#2.11)
~CONV_START: ADC (R14#2.1 U9.35), Teensy (J4#2.30)
~FAULT: ADC (R12#2.1 U9.42), Teensy (J4#2.29)
~RESET/PWDN: ADC (R9#2.2 U9.43), Teensy (J4#2.28)

## Assembly variants
Only Fabricated Components: not fitted R50